# EAGLE design TimeTracker_TestboardV1 (EAGLE 9.3.0)
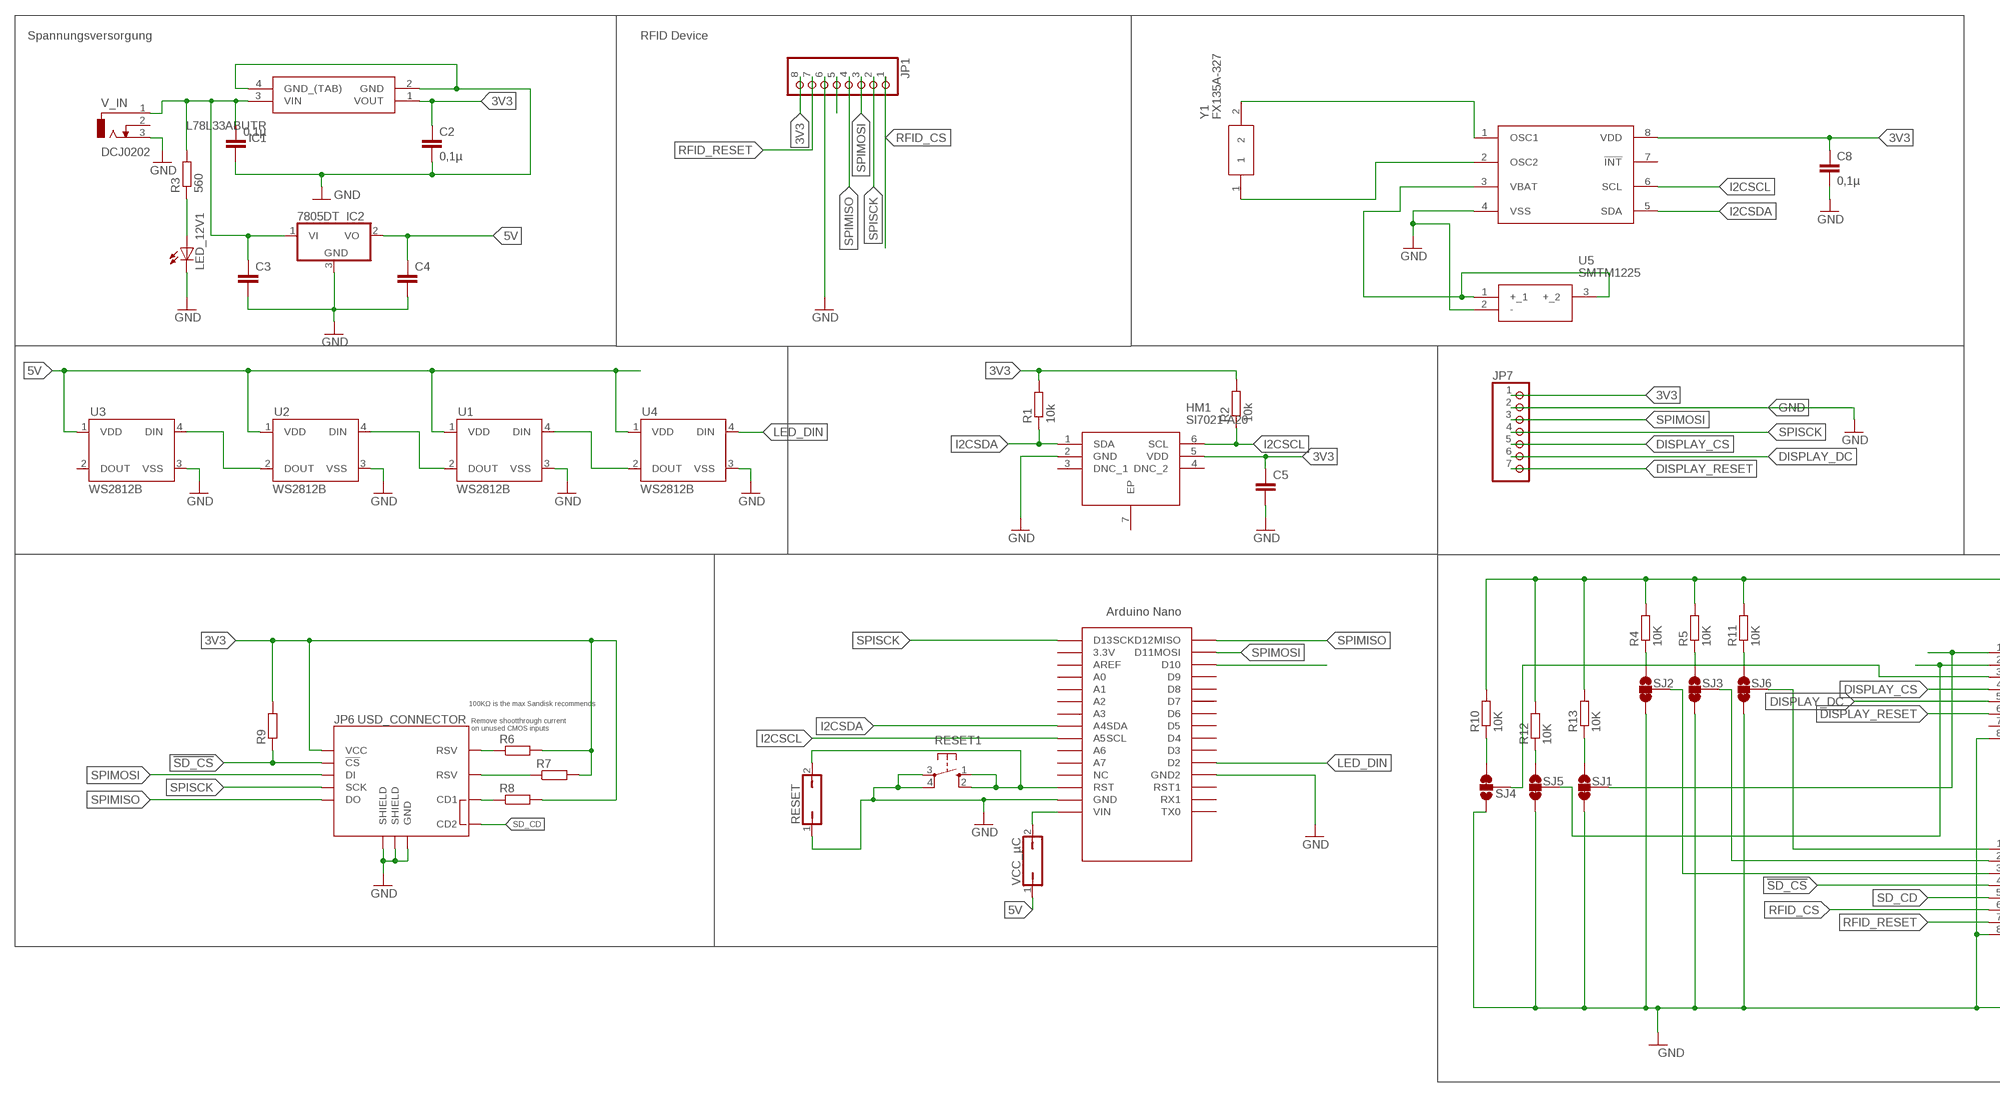
[diagram p0: schematic, sheet 1, part 1 of 2]
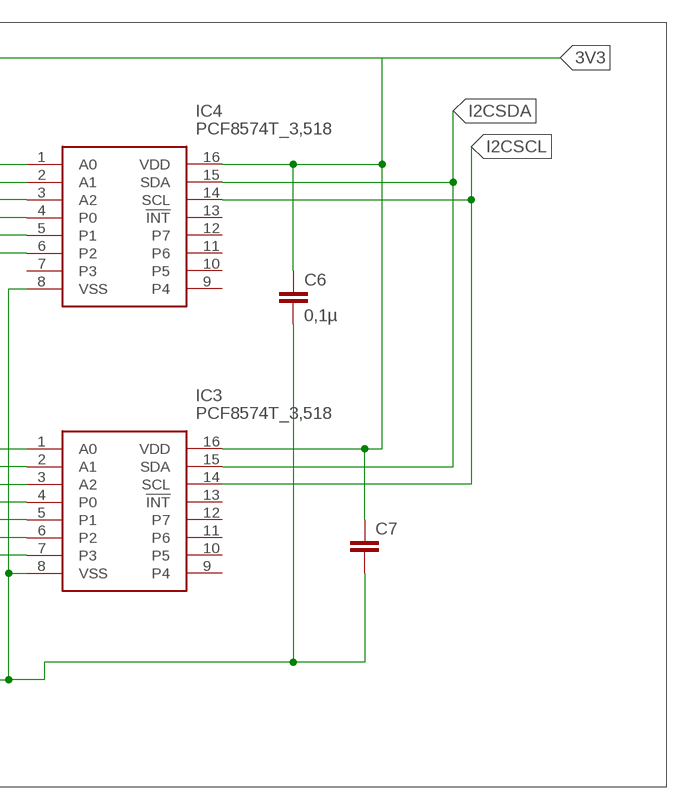
[diagram p1: schematic, sheet 1, part 2 of 2]

## Parts
0.1µ  C-EUC0805  [C0805]
C2  0,1µ  C-EUC0805  [C0805]
C3  C-EUC0805  [C0805]
C4  C-EUC0805  [C0805]
C5  C-EUC0805  [C0805]
C6  0,1µ  C-EUC0805  [C0805]
C7  C-EUC0805  [C0805]
C8  0,1µ  C-EUC0805  [C0805]
HM1  SI7021-A20  [SON100P300X300X80-7N]
IC1  L78L33ABUTR  [ST-SOT-89]
IC2  7805DT  [TO252]
IC3  PCF8574T_3,518  [SOIC127P1032X265-16N]
IC4  PCF8574T_3,518  [SOIC127P1032X265-16N]
JP1  PINHD-1X8  [1X08]
JP6  USD_CONNECTOR  [MICRO-SD-SOCKET-PP]
JP7  PINHD-1X7  [1X07]
LED_12V1  LEDSML0805  [SML0805]
R1  10k  R-EU_R0805  [R0805]
R2  10k  R-EU_R0805  [R0805]
R3  560  R-EU_R0805  [R0805]
R4  10K  R-EU_R0805  [R0805]
R5  10K  R-EU_R0805  [R0805]
R6  100k  R-EU_R0805  [R0805]
R7  100k  R-EU_R0805  [R0805]
R8  100k  R-EU_R0805  [R0805]
R9  100k  R-EU_R0805  [R0805]
R10  10K  R-EU_R0805  [R0805]
R11  10K  R-EU_R0805  [R0805]
R12  10K  R-EU_R0805  [R0805]
R13  10K  R-EU_R0805  [R0805]
RESET  JP1Q  [JP1]
RESET1  10-XX  [B3F-10XX]
SJ1  JUMPER-PAD-3-2OF3_NC_BY_TRACE_SMALL  [PAD-JUMPER-3-2OF3_NC_BY_TRACE_YES_SILK_FULL_BOX]
SJ2  JUMPER-PAD-3-2OF3_NC_BY_TRACE_SMALL  [PAD-JUMPER-3-2OF3_NC_BY_TRACE_YES_SILK_FULL_BOX]
SJ3  JUMPER-PAD-3-2OF3_NC_BY_TRACE_SMALL  [PAD-JUMPER-3-2OF3_NC_BY_TRACE_YES_SILK_FULL_BOX]
SJ4  JUMPER-PAD-3-2OF3_NC_BY_TRACE_SMALL  [PAD-JUMPER-3-2OF3_NC_BY_TRACE_YES_SILK_FULL_BOX]
SJ5  JUMPER-PAD-3-2OF3_NC_BY_TRACE_SMALL  [PAD-JUMPER-3-2OF3_NC_BY_TRACE_YES_SILK_FULL_BOX]
SJ6  JUMPER-PAD-3-2OF3_NC_BY_TRACE_SMALL  [PAD-JUMPER-3-2OF3_NC_BY_TRACE_YES_SILK_FULL_BOX]
U1  WS2812B  [WS2812B]
U2  WS2812B  [WS2812B]
U3  WS2812B  [WS2812B]
U4  WS2812B  [WS2812B]
U5  SMTM1225  [SMTM1225]
U$1  NANO  [NANO]
U$2  RTC  [SOP65P490X110-8N]
V_IN  DCJ0202  [DCJ0202]
VCC_µC  JP1Q  [JP1]
Y1  FX135A-327  [FX135]

## Nets
3V3: C2.1 C5.1 C6.1 C7.1 C8.1 HM1.5(VDD) IC1.1(VOUT) IC3.16(VDD) IC4.16(VDD) JP1.8 JP6.VCC JP7.1 R1.2 R2.2 R4.2 R5.2 R6.2 R7.2 R8.2 R9.2 R10.2 R11.2 R12.2 R13.2 U$2.8(VDD)
5V: C4.1 IC2.2(VO) U1.1(VDD) U2.1(VDD) U3.1(VDD) U4.1(VDD) VCC_µC.1
!SD_CS: IC3.4(P0) JP6.CS(!CS) R9.1
CDSDSD: JP6.CD1 R8.1
DISPLAY_CS: IC4.4(P0) JP7.5
DISPLAY_DC: IC4.5(P1) JP7.6
DISPLAY_RESET: IC4.6(P2) JP7.7
GND: 0.1µ.2 C2.2 C3.2 C4.2 C5.2 C6.2 C7.2 C8.2 HM1.2(GND) IC1.2(GND) IC1.4(GND_(TAB)) IC2.3(GND) IC3.8(VSS) IC4.8(VSS) JP1.6 JP6.GND JP6.GND1(SHIELD) JP6.GND3(SHIELD) JP7.2 LED_12V1.C RESET1.3(P) RESET1.4(P1) RESET.1 SJ1.3 SJ2.3 SJ3.3 SJ4.1 SJ5.3 SJ6.3 U1.3(VSS) U2.3(VSS) U3.3(VSS) U4.3(VSS) U5.2(-) U$1.GND U$1.GND1(GND2) U$2.4(VSS) V_IN.3
GND1: RESET1.1(S) RESET1.2(S1) RESET.2 U$1.RST
I2CSCL: HM1.6(SCL) IC3.14(SCL) IC4.14(SCL) R2.1 U$1.A5(A5SCL) U$2.6(SCL)
I2CSDA: HM1.1(SDA) IC3.15(SDA) IC4.15(SDA) R1.1 U$1.A4(A4SDA) U$2.5(SDA)
LED_DIN: U4.4(DIN) U$1.D2
N$1: 0.1µ.1 C3.1 IC1.3(VIN) IC2.1(VI) R3.2 V_IN.1
N$3: JP1.5
N$5: U$1.D10
N$6: IC3.1(A0) SJ6.2
N$7: IC3.2(A1) SJ3.2
N$8: IC3.3(A2) SJ2.2
N$9: U1.4(DIN) U4.2(DOUT)
N$10: U1.2(DOUT) U2.4(DIN)
N$11: U2.2(DOUT) U3.4(DIN)
N$12: U$1.RAW(VIN) VCC_µC.2
N$14: U$2.1(OSC1) Y1.2
N$15: U$2.2(OSC2) Y1.1
N$16: U5.1(+_1) U5.3(+_2) U$2.3(VBAT)
N$17: IC4.1(A0) SJ1.2
N$18: IC4.2(A1) SJ5.2
N$19: IC4.3(A2) SJ4.2
N$20: R10.1 SJ4.3
N$21: R11.1 SJ6.1
N$22: R5.1 SJ3.1
N$23: R4.1 SJ2.1
N$24: R12.1 SJ5.1
N$25: R13.1 SJ1.1
N$35: LED_12V1.A R3.1
RFID_CS: IC3.6(P2) JP1.1
RFID_RESET: IC3.7(P3) JP1.7
RSV@1: JP6.RSV1(RSV) R6.1
RSV@2: JP6.RSV2(RSV) R7.1
SD_CD: IC3.5(P1) JP6.CD2
SPIMISO: JP1.4 JP6.DO U$1.D12(D12MISO)
SPIMOSI: JP1.3 JP6.DI JP7.3 U$1.D11(D11MOSI)
SPISCK: JP1.2 JP6.SCLK(SCK) JP7.4 U$1.D13(D13SCK)
Unconnected: HM1.3(DNC_1) HM1.4(DNC_2) IC3.9(P4) IC3.10(P5) IC3.11(P6) IC3.12(P7) IC3.13(!INT) IC4.7(P3) IC4.9(P4) IC4.10(P5) IC4.11(P6) IC4.12(P7) IC4.13(!INT) U3.2(DOUT) U$1.3.3V U$1.5V(NC) U$1.A0 U$1.A1 U$1.A2 U$1.A3 U$1.A6 U$1.A7 U$1.AREF U$1.D3 U$1.D4 U$1.D5 U$1.D6 U$1.D7 U$1.D8 U$1.D9 U$1.RST1 U$1.RX1 U$1.TX0 U$2.7(!INT) V_IN.2

## Notes on the sheet
- Spannungsversorgung | RFID Device
- 100KΩ is the max Sandisk recommends
- Remove shootthrough current
  on unused CMOS inputs

## Power pins joined to a net without a drawn wire
EP: HM1.7(EP)

## Library data of the parts
0.1µ C2-C8 = rcl:C-EU: CAPACITOR, European symbol; SPICEPREFIX: C
HM1 = SamacSys_Parts:SI7021-A20: I2C HUMIDITY AND TEMPERATURE SENSOR Source: Datasheet <https://www.silabs.com/Support Documents/TechnicalDocs/Si7021-A20.pdf>; DESCRIPTION: I2C HUMIDITY AND TEMPERATURE SENSOR; HEIGHT: 0.8mm; MANUFACTURER_NAME: Silicon Labs; MANUFACTURER_PART_NUMBER: Si7021-A20
IC1 = SamacSys_Parts:L78L33ABUTR: L78L33ABUTR, Voltage Regulator, 0.1A 3.3 V, 4-Pin SOT-89 Source: Datasheet <http://www.st.com/web/en/resource/technical/document/datasheet/CD00000446.pdf>; ALLIED_NUMBER: 70390115; ALLIED_PRICE-STOCK: http://www.alliedelec.com/stmicroelectronics-l78l33abutr/70390115/; DESCRIPTION: L78L33ABUTR, Voltage Regulator, 0.1A 3.3 V, 4-Pin SOT-89; HEIGHT: mm; MANUFACTURER_NAME: STMicroelectronics; MANUFACTURER_PART_NUMBER: L78L33ABUTR; MOUSER_PART_NUMBER: 511-L78L33ABU-TR; MOUSER_PRICE-STOCK: https://www.mouser.com/Search/Refine.aspx?Keyword=511-L78L33ABU-TR; RS_PART_NUMBER: 6869464P; RS_PRICE-STOCK: http://uk.rs-online.com/web/p/products/6869464P
IC2 = linear:78*: Positive VOLTAGE REGULATOR Source: http://cache.national.com/ds/LM/LM78L05.pdf http://www.fairchildsemi.com/ds/LM/LM7805.pdf
IC3 IC4 = SamacSys_Parts:PCF8574T_3,518: NXP - PCF8574T/3,518 - IC, I/O EXPANDER, 8BIT, SOIC16 Source: Datasheet <https://www.nxp.com/docs/en/data-sheet/PCF8574_PCF8574A.pdf>; DESCRIPTION: NXP - PCF8574T/3,518 - IC, I/O EXPANDER, 8BIT, SOIC16; HEIGHT: 2.65mm; MANUFACTURER_NAME: Nexperia; MANUFACTURER_PART_NUMBER: PCF8574T/3,518; MOUSER_PART_NUMBER: 771-PCF8574TD-T; MOUSER_PRICE-STOCK: https://www.mouser.com/Search/Refine.aspx?Keyword=771-PCF8574TD-T
JP1 = pinhead:PINHD-1X8: PIN HEADER
JP6 = SparkFun-Connectors:USD_CONNECTOR: microSD Socket Push-push type µSD socket. Footprint production proven. Symbol has new and improved layout and naming accuracy. SparkFun Electronics SKU : PRT-00127. tDoc lines correctly indicate media card edge positions when inserting (unlocked, locked, depressed). NOTE: CD1 and CD2 are connected internally; PROD_ID: CONN-07820
JP7 = pinhead:PINHD-1X7: PIN HEADER
LED_12V1 = led:LED: LED OSRAM: - CHIPLED LG R971, LG N971, LY N971, LG Q971, LY Q971, LO R971, LY R971 LH N974, LH R974 LS Q976, LO Q976, LY Q976 LO Q996 - Hyper CHIPLED LW Q18S LB Q993, LB Q99A, LB R99A - SideLED LS A670, LO A670, LY A670, LG A670, LP A670 LB A673, LV A673, LT A673, LW A673 LH A674 LY A675 LS A676, LA A676, LO A676, LY A676, LW A676 LS A679, LY A679, LG A679 - Hyper Micro SIDELED® LS Y876, LA Y876, LO Y876, LY Y876 LT Y87S - SmartLED LW L88C, LW L88S LB L89C, LB L89S, LG L890 LS L89K, LO L89K, LY L89K LS L896, LA L896, LO L896, LY L896 - TOPLED LS T670, LO T670, LY T670, LG T670, LP T670 LSG T670, LSP T670, LSY T670, LOP T670, LYG T670 LG T671, LOG T671, LSG T671 LB T673, LV T673, LT T673, LW T673 LH T674 LS T676, LA T676, LO T676, LY T676, LB T676, LH T676, LSB T676, LW T676 LB T67C, LV T67C, LT T67C, LS T67K, LO T67K, LY T67K, LW E67C LS E67B, LA E67B, LO E67B, LY E67B, LB E67C, LV E67C, LT E67C LW T67C LS T679, LY T679, LG T679 LS T770, LO T770, LY T770, LG T770, LP T770 LB T773, LV T773, LT T773, LW T773 LH T774 LS E675, LA E675, LY E675, LS T675 LS T776, LA T776, LO T776, LY T776, LB T776 LHGB T686 LT T68C, LB T68C - Hyper Mini TOPLED® LB M676 - Mini TOPLED Santana® LG M470 LS M47K, LO M47K, LY M47K Source: http://www.osram.convergy.de LUXEON: - LUMILED® LXK2-PW12-R00, LXK2-PW12-S00, LXK2-PW14-U00, LXK2-PW14-V00 LXK2-PM12-R00, LXK2-PM12-S00, LXK2-PM14-U00 LXK2-PE12-Q00, LXK2-PE12-R00, LXK2-PE12-S00, LXK2-PE14-T00, LXK2-PE14-U00 LXK2-PB12-K00, LXK2-PB12-L00, LXK2-PB12-M00, LXK2-PB14-N00, LXK2-PB14-P00, LXK2-PB14-Q00 LXK2-PR12-L00, LXK2-PR12-M00, LXK2-PR14-Q00, LXK2-PR14-R00 LXK2-PD12-Q00, LXK2-PD12-R00, LXK2-PD12-S00 LXK2-PH12-R00, LXK2-PH12-S00 LXK2-PL12-P00, LXK2-PL12-Q00, LXK2-PL12-R00 Source: www.luxeon.com KINGBRIGHT: KA-3528ASYC Source: www.kingbright.com
R1-R13 = rcl:R-EU_: RESISTOR, European symbol; SPICEPREFIX: R
RESET VCC_µC = jumper:JP1Q: JUMPER
RESET1 = switch-omron:10-XX: OMRON SWITCH; MPN: B3F-1000; OC_FARNELL: 176432; OC_NEWARK: 36M3542
SJ1-SJ6 = SparkFun-Passives:JUMPER-PAD-3-2OF3_NC_BY_TRACE
U1-U4 = SparkFun-LED:WS2812B: WS2812B - Intelligent control LED integrated light source Technical Specifications: Power Supply Voltage (VDD): 3.5 to 5.3 V Input Voltage (VI): -0.5 to VDD+0.5 V Operating Junction Temperature (Topt): -25°C to +80°C Storage Temperature Range (Tstg): -55°C to +150°C; PROD_ID: DIO-12503
U5 = SamacSys_Parts:SMTM1225: Coin Cell Battery Holders SMT HOLDER FOR CR1225 Source: Datasheet <http://www.mouser.com/ds/2/346/3.9226.4-3_SMTM1225-258011.pdf>; DESCRIPTION: Coin Cell Battery Holders SMT HOLDER FOR CR1225; HEIGHT: mm; MANUFACTURER_NAME: RENATA; MANUFACTURER_PART_NUMBER: SMTM1225; MOUSER_PART_NUMBER: 614-SMTM1225; MOUSER_PRICE-STOCK: https://www.mouser.com/Search/Refine.aspx?Keyword=614-SMTM1225
U$1 = NanoUSW:NANO: Arduino Nano
U$2 = SOP65P490X110-8N:RTC
V_IN = con-jack:DCJ0202: DC POWER JACK Source: DCJ0202.pdf; OC_FARNELL: unknown; OC_NEWARK: unknown
Y1 = SamacSys_Parts:FX135A-327: Crystal SMD 32.768kHz 1.5x3.2mm Crystal 32.768kHz, +/-20ppm, 2-Pin SMD, 3.2 x 1.5 x 0.9mm Source: Datasheet <http://www.foxonline.com/pdfs/FX135.pdf>; DESCRIPTION: Crystal SMD 32.768kHz 1.5x3.2mm Crystal 32.768kHz, +/-20ppm, 2-Pin SMD, 3.2 x 1.5 x 0.9mm; HEIGHT: mm; MANUFACTURER_NAME: Fox; MANUFACTURER_PART_NUMBER: FX135A-327; MOUSER_PART_NUMBER: 559-FX135A-327; MOUSER_PRICE-STOCK: https://www.mouser.com/Search/Refine.aspx?Keyword=559-FX135A-327; RS_PART_NUMBER: 6480200P; RS_PRICE-STOCK: http://uk.rs-online.com/web/p/products/6480200P

## Board
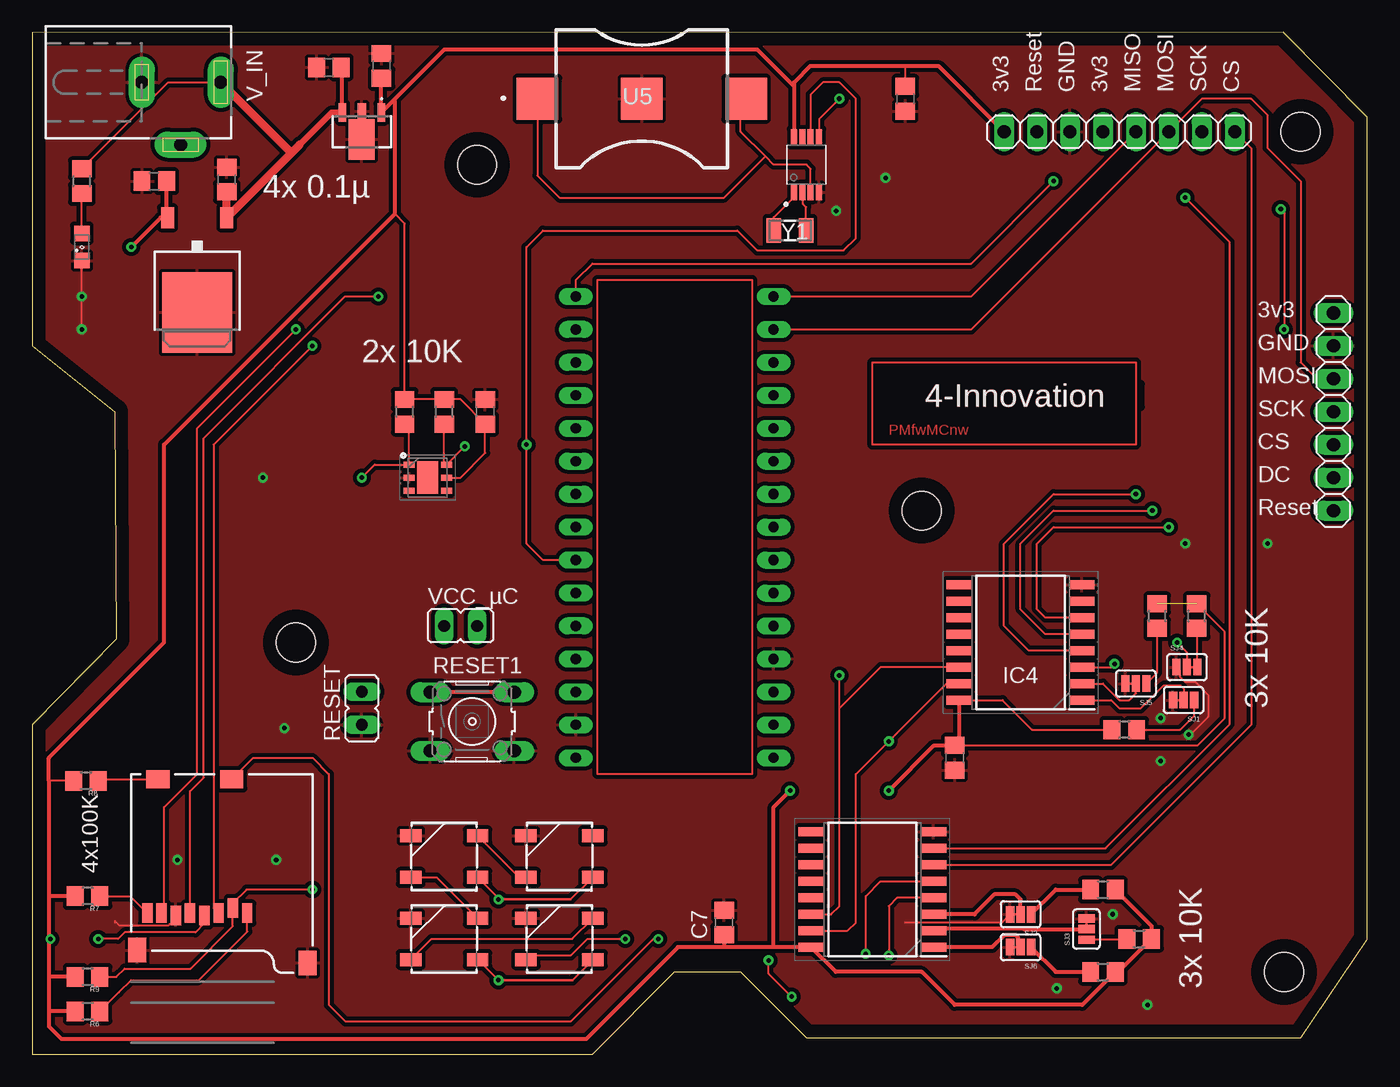
[diagram p2: board, top side]
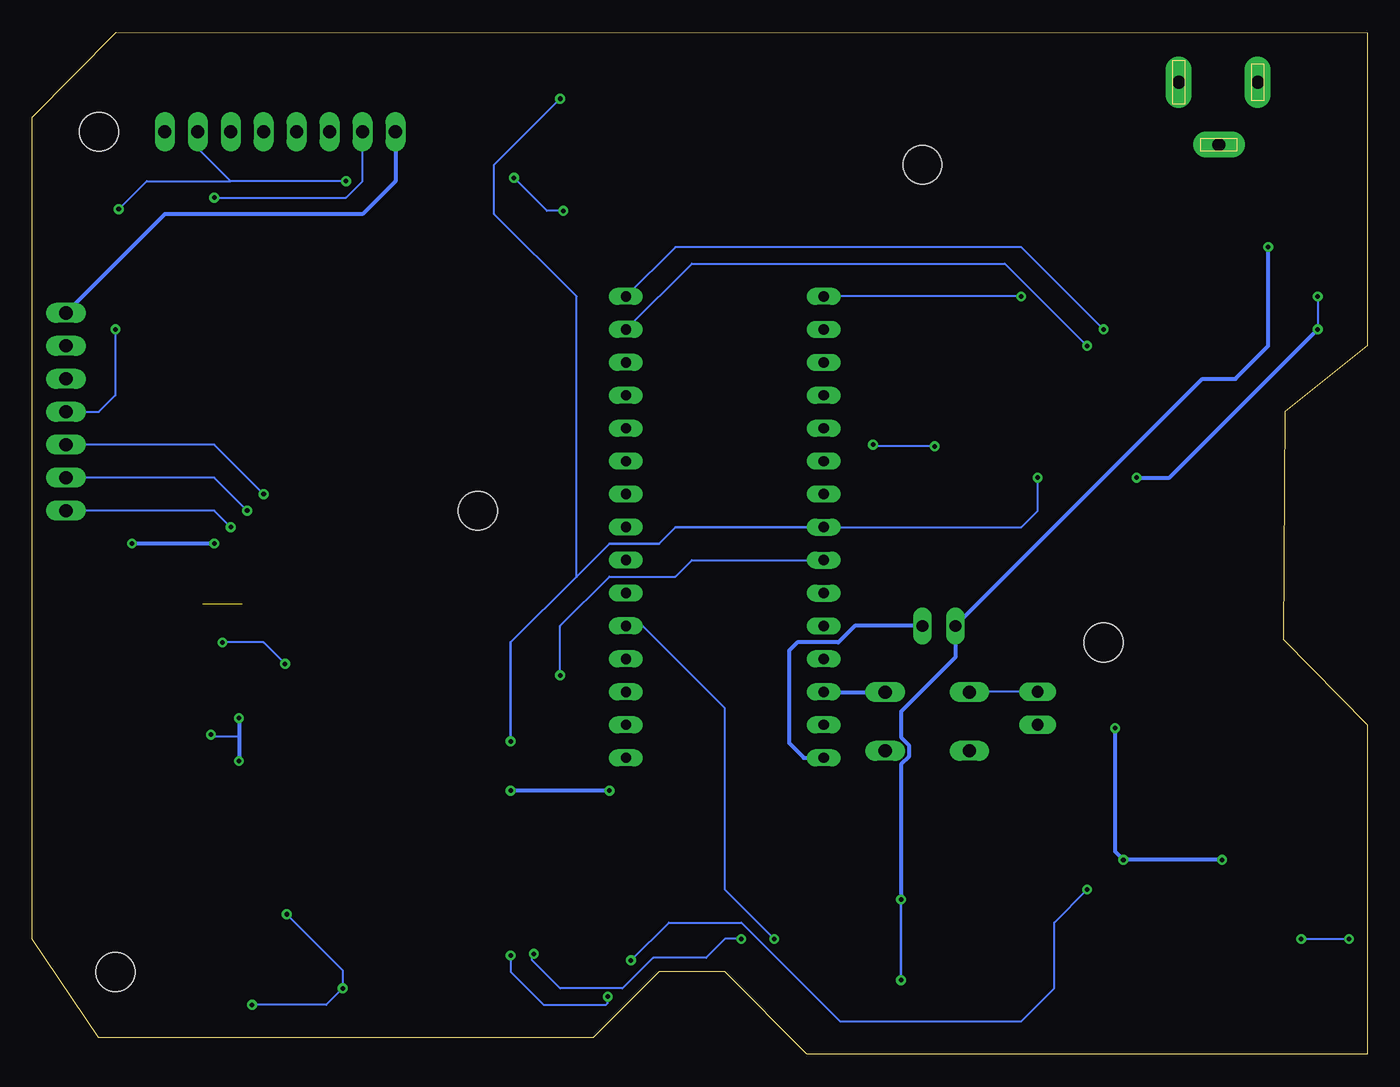
[diagram p3: board, bottom side, seen from below]

Size 102.92 x 78.77 mm. Coordinates in mm from the lower left corner, seen from the top.
Outline: 0,0 43.18,0 49.53,6.35 54.61,6.35 59.69,1.27 97.79,1.27 102.92,8.86 102.92,72.25 96.46,78.77 0,78.73 0,54.61 6.35,49.53 6.48,32 0,25.4 0,0
Copper layers (1*16): Top 0.035mm / dielectric 1.5mm / Bottom 0.035mm
Design rules "default": minimum track width 6mil, minimum drill 0.35mm, track to track 6mil, track to pad 6mil, pad to pad 6mil, via to via 6mil, smd to smd 6mil, copper to edge 40mil, drill to drill 6mil, minimum pad ring 10mil, minimum via ring 8mil, stop-mask expansion 4mil, vias tented up to drill 0mil, thermal gap 10mil
Holes 3 mm at 97.79,71.12 96.52,6.35 20.32,31.75 34.29,68.58 68.58,41.91

### Footprints (pad centres in the part's own frame; a part is rotated, then mirrored left to right if it is on the bottom)
C0805 = smd 1.3 x 1.5: 1 -0.95,0; 2 0.95,0
SON100P300X300X80-7N = smd 0.85 x 0.45: 1 -1.45,1; 2 -1.45,0; 3 -1.45,-1; 4 1.45,-1; 5 1.45,0; 6 1.45,1 | smd 1.6 x 2.5: 7 0,0
ST-SOT-89 = smd 0.57 x 1.4: 1 -1.5,-1.475; 3 1.5,-1.475 | smd 0.65 x 1.2: 2 0,-1.575 | smd 2 x 3.15: 4 0,0.6
TO252 = smd 1 x 1.6: 1 -2.28,-4.8; 2 2.28,-4.8 | smd 5.4 x 6.2: 3 0,2.5
SOIC127P1032X265-16N = smd 1.95 x 0.7: 1 -4.725,4.445; 2 -4.725,3.175; 3 -4.725,1.905; 4 -4.725,0.635; 5 -4.725,-0.635; 6 -4.725,-1.905; 7 -4.725,-3.175; 8 -4.725,-4.445; 9 4.725,-4.445; 10 4.725,-3.175; 11 4.725,-1.905; 12 4.725,-0.635; 13 4.725,0.635; 14 4.725,1.905; 15 4.725,3.175; 16 4.725,4.445
1X08 = drill 1.016 long: 1 -8.89,0; 2 -6.35,0; 3 -3.81,0; 4 -1.27,0; 5 1.27,0; 6 3.81,0; 7 6.35,0; 8 8.89,0
MICRO-SD-SOCKET-PP = smd 1.8 x 1.4: CD1 -2.05,0.4; CD2 -7.75,0.4 | smd 0.8 x 1.5: CS -7.84,10.3; DI -6.74,10.7; DO -2.34,10.7; GND -3.44,10.9; RSV1 -8.94,10.7; RSV2 -1.24,10.7; SCLK -4.54,10.7; VCC -5.64,10.9 | smd 1.4 x 1.9: GND1 -13.6,14.55; GND3 -0.45,13.55
1X07 = drill 1.016 long: 1 -7.62,0; 2 -5.08,0; 3 -2.54,0; 4 0,0; 5 2.54,0; 6 5.08,0; 7 7.62,0
SML0805 = smd 1.2 x 1.2: A 1.05,0; C -1.05,0
R0805 = smd 1.3 x 1.5: 1 -0.95,0; 2 0.95,0
JP1 = drill 0.914 long: 1 0,-1.27; 2 0,1.27
B3F-10XX = drill 1.016 long: 1 -3.251,2.261; 2 3.251,2.261; 3 -3.251,-2.261; 4 3.251,-2.261
PAD-JUMPER-3-2OF3_NC_BY_TRACE_YES_SILK_FULL_BOX = smd 0.635 x 1.27: 1 -0.813,0; 2 0,0; 3 0.813,0
WS2812B = smd 1.651 x 1: 1 -2.577,1.6; 2 -2.577,-1.6; 3 2.577,-1.6; 4 2.577,1.6
SMTM1225 = smd 3.2 x 3.2: 1 -8.05,0; 2 0,0; 3 8.05,0
NANO = drill 0.8 long: 3.3V -10.16,24.13; 5V -10.16,-1.27; A0 -10.16,19.05; A1 -10.16,16.51; A2 -10.16,13.97; A3 -10.16,11.43; A4 -10.16,8.89; A5 -10.16,6.35; A6 -10.16,3.81; A7 -10.16,1.27; AREF -10.16,21.59; D2 5.08,1.27; D3 5.08,3.81; D4 5.08,6.35; D5 5.08,8.89; D6 5.08,11.43; D7 5.08,13.97; D8 5.08,16.51; D9 5.08,19.05; D10 5.08,21.59; D11 5.08,24.13; D12 5.08,26.67; D13 -10.16,26.67; GND -10.16,-6.35; GND1 5.08,-1.27; RAW -10.16,-8.89; RST -10.16,-3.81; RST1 5.08,-3.81; RX1 5.08,-6.35; TX0 5.08,-8.89
SOP65P490X110-8N = smd 1.25 x 0.46: 1 -2.11,0.975; 2 -2.11,0.325; 3 -2.11,-0.325; 4 -2.11,-0.975; 5 2.11,-0.975; 6 2.11,-0.325; 7 2.11,0.325; 8 2.11,0.975
DCJ0202 = drill 1 pad 2 long: 1 0,3.1; 2 4.8,0; 3 0,-3
FX135 = smd 1.1 x 1.9: 1 -1.25,0; 2 1.25,0

### Placement (x,y rotation side)
0.1µ  22.86,76.07 180 top
C2  26.92,76.2 90 top
C3  14.99,67.44 90 top
C4  9.4,67.31 180 top
C5  34.92,49.53 90 top
C6  71.12,22.86 270 top
C7  53.34,10.16 90 top
C8  67.31,73.66 270 top
HM1  30.48,44.45 0 top
IC1  25.4,71.12 180 top
IC2  12.7,59.69 180 top
IC3  64.77,12.7 180 top
IC4  76.2,31.75 180 top
JP1  83.82,71.12 180 top
JP6  7.62,21.59 180 top
JP7  100.33,49.53 270 top
LED_12V1  3.81,62.23 90 top
R1  28.7,49.53 90 top
R2  31.75,49.53 90 top
R3  3.81,67.31 90 top
R4  82.55,12.7 0 top
R5  85.34,8.89 0 top
R6  4.25,3.3 180 top
R7  4.25,12.19 180 top
R8  4.12,21.08 180 top
R9  4.25,5.97 180 top
R10  89.79,33.78 90 top
R11  82.55,6.35 0 top
R12  86.74,33.78 90 top
R13  84.2,25.02 180 top
RESET  25.4,26.67 0 top
RESET1  33.91,25.65 0 top
SJ1  88.77,27.3 180 top
SJ2  76.2,10.79 180 top
SJ3  81.28,9.65 90 top
SJ4  89.03,29.84 0 top
SJ5  85.09,28.57 180 top
SJ6  76.2,8.26 180 top
U1  31.75,8.89 180 top
U2  31.75,15.24 180 top
U3  40.64,15.24 180 top
U4  40.64,8.89 180 top
U5  46.99,73.66 0 top
U$1  52.07,31.75 0 top
U$2  59.69,68.58 90 top
V_IN  11.43,74.93 270 top
VCC_µC  33.02,33.02 270 top
Y1  58.42,63.5 180 top

### Tracks (layer width: path | path; a pad name or v marks a point on that pad's centre or on a via)
3V3  (via drill 0.35)  (1 unrouted)
  Top 0.152: JP6.VCC 13.26,10.08 12.57,9.4 7.11,9.4 6.6,8.89 v5.08,8.89 | R8.2 1.27,21.08 | HM1.5 33.02,44.45 34.92,46.36 C5.1 33.02,50.48 R2.2 R1.2 28.7,64.03 27.95,64.78 | C6.1 89.85,23.81 91.95,25.91 91.95,32.57 R10.2 | IC4.16 74.8,27.3 77.09,25.02 R13.2 | C8.1 67.31,76.2 | v1.39,8.89 1.27,8.89
  Top 0.305: 1.27,12.06 1.27,21.08 1.27,22.86 10.16,31.75 10.16,46.99 27.95,64.78 27.95,73.65 | 1.27,12.06 1.27,8.89 1.27,5.97 | 1.27,5.97 1.27,3.3 | 1.27,3.3 1.27,2.16 2.26,1.17 42.7,1.17 49.78,8.26 53.34,8.26 | R7.2 1.4,12.19 1.27,12.06 | R9.2 1.27,5.97 | R6.2 1.27,3.3 | 58.71,74.63 U$2.8 | 58.71,74.63 55.88,77.47 31.77,77.47 27.95,73.65 | JP1.8 69.85,76.2 67.31,76.2 60.01,76.2 58.71,74.91 58.71,74.63 | 27.95,73.65 IC1.1 26.9,75.23 | 57.15,8.26 IC3.16 61.95,6.35 68.58,6.35 71.12,3.81 80.96,3.81 R11.2 83.75,6.35 R5.2 86.29,9.91 R4.2 | 57.15,8.26 53.34,8.26 | C7.1 53.34,8.26 | 57.15,8.26 57.15,19.05 v58.42,20.32 | v66.04,20.32 69.53,23.81 C6.1 71.48,24.16 IC4.16
  Top 0.508: 26.9,75.23 C2.1
  Bottom 0.152: v5.08,8.89 v1.39,8.89
  Bottom 0.305: v58.42,20.32 v66.04,20.32 | JP1.8 74.93,67.31 77.47,64.77 92.71,64.77 JP7.1
5V  (via drill 0.35)
  Top 0.203: U2.1 35.81,12.15 35.81,11.94 v35.94,11.94 41.52,11.94 U3.1 | U4.1 41.64,5.71 v35.94,5.71 34.37,7.29 U1.1
  Top 0.305: v7.62,62.23 9.88,64.49 IC2.2 | IC2.2 | IC2.2 10.35,64.56 C4.1
  Bottom 0.203: v35.94,11.94 35.94,5.84 36.07,5.71 v35.94,5.71
  Bottom 0.305: v7.62,62.23 7.62,54.61 10.16,52.07 12.7,52.07 VCC_µC.1 31.75,30.61 35.94,26.42 35.94,24.45 35.33,23.84 35.33,22.95 35.94,22.34 v35.94,11.94
!SD_CS  (via drill 0.35)
  Top 0.152: R9.1 6.47,5.97 7.11,6.6 12.19,6.6 15.46,9.87 JP6.CS 15.46,11.65 16.51,12.7 v21.59,12.7 | IC3.4 66.68,12.06 66.04,11.43 v66.04,7.62 | v58.55,4.45 56.77,6.22 v56.77,7.24
  Bottom 0.152: v66.04,7.62 66.04,6.35 63.5,3.81 58.7,3.81 58.56,3.95 v58.56,4.44 v58.55,4.45 | v56.77,7.24 53.85,10.16 48.26,10.16 40.64,2.54 26.67,2.54 24.13,5.08 24.13,10.16 v21.59,12.7
CDSDSD
  Top 0.152: R8.1 5.18,21.19 JP6.CD1
DISPLAY_CS  (via drill 0.35)
  Top 0.152: IC4.4 76.84,31.11 74.93,33.02 74.93,39.37 78.74,43.18 v85.09,43.18
  Bottom 0.152: v85.09,43.18 88.9,46.99 JP7.5
DISPLAY_DC  (via drill 0.35)
  Top 0.152: IC4.5 78.11,32.38 76.2,34.29 76.2,39.37 78.74,41.91 v86.36,41.91
  Bottom 0.152: v86.36,41.91 88.9,44.45 JP7.6
DISPLAY_RESET  (via drill 0.35)
  Top 0.152: IC4.6 78.11,33.66 77.47,34.29 77.47,39.37 78.74,40.64 v87.63,40.64
  Bottom 0.152: v87.63,40.64 88.9,41.91 JP7.7
GND  (via drill 0.35)
  Top 0.152: SJ4.1 88.48,29.58 88.48,29.11 88.89,28.7 89.66,28.7 90.68,27.69 90.68,26.04 89.28,24.64 v89.15,24.64 | SJ2.3 74.75,10.16 67.31,10.16 | JP6.GND 11.05,10.03 10.58,10.03 10.46,9.91 6.73,9.91 6.35,10.29 6.35,10.16 | v3.81,55.88 LED_12V1.C
  Bottom 0.152: v89.15,24.64 89.03,24.51 87,24.51 | v83.31,10.79 78.99,6.48 v78.99,5.08 80.26,3.81 v85.98,3.81 | v3.81,58.42 v3.81,55.88 | v61.98,65.02 63.25,65.02 v65.79,67.56
  Bottom 0.305: v3.81,55.88 15.24,44.45 v17.78,44.45 | v88.9,39.37 v95.25,39.37 | v11.18,14.99 v18.8,14.99 19.43,15.62 v19.43,25.15 | v87,25.91 87,24.51 v87,22.61
  pour Top (isolate 0.305): 12.7,93.98 89.78,93.98 111.76,72 111.76,-1.27 -19.05,-1.27 -19.05,62.23
GND1
  Top 0.305: RESET1.2 RESET1.1
  Bottom 0.152: RESET.2 30.63,27.94 RESET1.1
  Bottom 0.305: U$1.RST 41.88,27.91 RESET1.2
I2CSCL  (via drill 0.35)
  Top 0.152: U$1.A5 39.37,38.1 38.1,39.37 v38.1,46.99 38.1,62.23 39.37,63.5 54.36,63.5 55.88,61.98 62.56,61.98 63.5,62.92 63.5,73.66 62.23,74.93 60.96,74.93 60.02,73.98 U$2.6 | R2.1 31.75,45.63 HM1.6 v33.34,46.86 33.4,46.86 | IC3.14 61.59,10.79 62.23,11.43 62.23,26.67 | 62.23,26.67 v62.23,29.21 | 62.23,26.67 65.41,29.84 IC4.14
  Bottom 0.152: v33.34,46.86 38.1,46.86 v38.1,46.99 | v62.23,29.21 62.23,33.02 58.42,36.83 53.34,36.83 52.07,38.1 U$1.A5
I2CSDA  (via drill 0.35)
  Top 0.152: v62.23,73.66 60.66,72.09 U$2.5 | R1.1 29.03,48.25 HM1.1 26.4,45.45 v25.4,44.45 | IC3.15 62.87,9.53 63.5,10.16 63.5,21.59 v66.04,24.13 70.48,28.57 IC4.15
  Bottom 0.152: 60.96,36.83 60.96,58.42 67.31,64.77 67.31,68.58 v62.23,73.66 | v25.4,44.45 25.4,41.91 26.67,40.64 U$1.A4
  Bottom 0.203: U$1.A4 53.34,40.64 54.61,39.37 58.42,39.37 60.96,36.83 66.04,31.75 v66.04,24.13
LED_DIN  (via drill 0.35)
  Top 0.152: U4.4 38.39,7.62 41.53,7.62 42.8,8.89 v45.72,8.89
  Bottom 0.152: v45.72,8.89 49.53,12.7 49.53,26.67 55.88,33.02 U$1.D2
N$1
  Top 0.152: R3.2 10.48,74.93 V_IN.1
  Top 0.305: IC1.3 23.9,75.98 0.1µ.1
  Top 0.508: IC1.3 23.06,72.59 20.6,70.13 19.96,69.49 | 23.9,75.61 0.1µ.1
  Top 0.61: V_IN.1 19.96,69.49 | 20.6,70.13 20.6,70.11 IC2.1 C3.1
N$2
  Top 0.152: 64.77,53.34 85.09,53.34 85.09,46.99 64.77,46.99 64.77,53.34
N$6
  Top 0.305: SJ6.2 76.01,8.45 76.01,9.02 75.83,9.2 74.94,9.2 74,8.26 IC3.1
N$7
  Top 0.305: SJ3.2 76.47,9.65 76.39,9.73 69.7,9.73 IC3.2
N$8
  Top 0.305: SJ2.2 76.2,11.94 75.82,12.32 74.17,12.32 72.64,10.79 IC3.3
N$9
  Top 0.152: U1.4 30.77,8.89 41.62,8.89 U4.2
N$10
  Top 0.152: U2.4 31.18,13.64 U1.2
N$11
  Top 0.152: U2.2 37.53,13.64 U3.4
N$12
  Bottom 0.305: VCC_µC.2 39.5,33.02 40.77,31.75 43.94,31.75 44.58,31.11 44.58,24 43.43,22.86 U$1.RAW
N$13
  Top 0.152: 43.56,59.69 55.5,59.69 55.5,21.59 43.56,21.59 43.56,59.69
N$14
  Top 0.152: Y1.2 57.17,64.54 58.71,66.08 U$2.1
N$15
  Top 0.152: Y1.1 59.67,65.3 59.44,65.53 59.44,66.4 U$2.2
N$16
  Top 0.152: U$2.3 60.02,68.25 59.69,68.58 57.15,68.58 56.52,69.21 | U5.3 54.61,73.23 54.61,71.12 56.52,69.21 | U5.1 38.94,67.74 40.64,66.04 53.34,66.04 56.52,69.21
N$17
  Top 0.152: SJ1.2 88.77,28.19 88.52,28.45 87.25,28.45 85.47,26.67 83.82,26.67 83.19,27.3 IC4.1
N$18
  Top 0.152: IC4.2 82.55,28.57 83.82,27.3 84.58,27.3 85.09,27.81 SJ5.2
N$19  (via drill 0.35)
  Top 0.152: 89.03,29.34 SJ4.2 89.03,30.99 v88.27,31.75 | 81.05,29.72 IC4.3 83.19,29.84 v83.44,30.1
  Bottom 0.152: v83.44,30.1 85.09,31.75 v88.27,31.75
N$20
  Top 0.152: SJ4.3 89.84,32.78 R10.1
N$21
  Top 0.305: SJ6.1 78.92,6.35 R11.1
N$22
  Top 0.152: R5.1 84.34,8.84 SJ3.1
N$23
  Top 0.305: SJ2.1 78.92,12.7 R4.1
N$24
  Top 0.152: SJ5.1 86.74,29.41 R12.1
N$25
  Top 0.152: R13.1 88.52,25.02 89.59,26.09 SJ1.1
N$35
  Top 0.152: LED_12V1.A R3.1
RFID_CS
  Top 0.152: JP1.1 93.98,69.85 93.98,25.4 83.19,14.61 IC3.6
RFID_RESET  (via drill 0.35)
  Top 0.152: v88.9,66.04 92.33,62.61 92.33,25.45 82.75,15.88 IC3.7
  Bottom 0.152: v88.9,66.04 78.74,66.04 77.47,67.31 JP1.7
RSV@1
  Top 0.152: R6.1 6.67,4.77 7.62,5.71 12.83,5.71 16.56,9.45 JP6.RSV1
RSV@2
  Top 0.152: R7.1 7.56,12.19 JP6.RSV2
SD_CD  (via drill 0.35)
  Top 0.152: JP6.CD2 17.04,22.86 21.59,22.86 22.86,21.59 22.86,3.81 24.13,2.54 41.53,2.54 47.88,8.89 v48.26,8.89 | v64.26,7.75 64.26,12.19 65.41,13.33 IC3.5
  Bottom 0.152: v48.26,8.89 49.53,8.89 50.98,7.44 55.06,7.44 57.42,5.08 62.23,5.08 64.39,7.24 64.39,7.75 v64.26,7.75
SPIMISO  (via drill 0.35)
  Top 0.152: U$1.D12 72.39,58.42 JP1.4 | JP6.DO 10.16,11.09 10.16,19.05 12.7,21.59 12.7,48.26 v20.32,55.88
  Bottom 0.152: v20.32,55.88 26.67,62.23 53.34,62.23 U$1.D12
SPIMOSI  (via drill 0.35)
  Top 0.152: U$1.D11 72.39,55.88 JP1.3 90.17,73.66 93.98,73.66 95.25,72.39 95.25,69.85 97.79,67.31 97.79,53.34 99.06,52.07 JP7.3 | v21.59,54.61 13.97,46.99 13.97,11.28 JP6.DI
  Bottom 0.152: U$1.D11 52.07,60.96 27.94,60.96 v21.59,54.61
SPISCK  (via drill 0.35)
  Top 0.152: U$1.D13 41.91,59.69 43.18,60.96 72.39,60.96 v78.74,67.31 | JP6.SCLK 12.16,20.29 13.21,21.34 13.21,47.5 24.13,58.42 v26.67,58.42 | v96.27,65.15 96.52,64.9 v96.52,55.88
  Bottom 0.152: v78.74,67.31 87.63,67.31 | 87.63,67.31 90.17,69.85 JP1.2 | v26.67,58.42 U$1.D13 | JP7.4 97.79,49.53 96.52,50.8 v96.52,55.88 | v96.27,65.15 94.11,67.31 87.63,67.31

### Text on the board
Top: 4-Innovation | PMfwMCnw
tNames: 3v3 | Reset | GND | 3v3 | MISO | MOSI | SCK | CS | 4x 0.1µ | 3v3 | GND | 2x 10K | MOSI | 4-Innovation | SCK | CS | DC | Reset | 3x 10K | 4x100K | 3x 10K